# Altium schematic sheet TopLevel.SchDoc
size A4
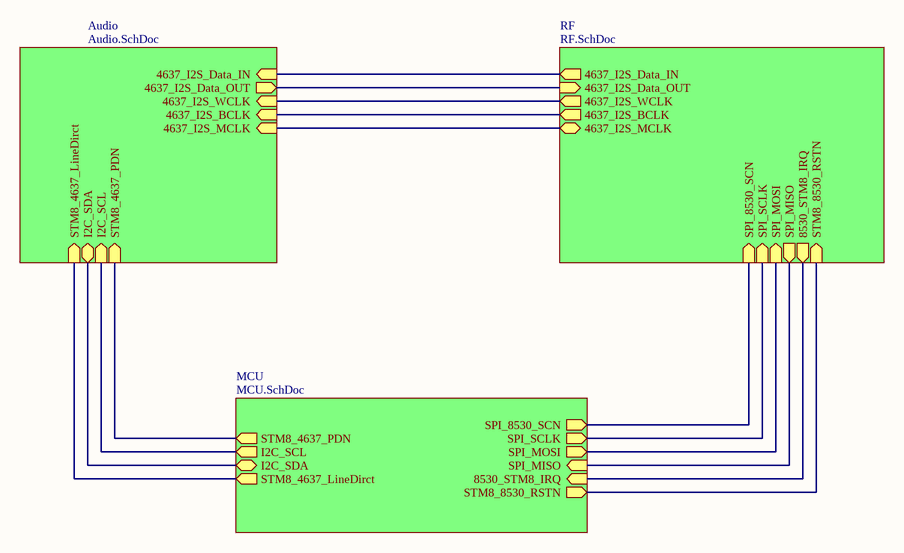
[diagram p0: TopLevel.SchDoc]

## Sub-sheets
Audio = Audio.SchDoc: 4637_I2S_Data_IN (in), 4637_I2S_Data_OUT (out), 4637_I2S_WCLK (in), 4637_I2S_BCLK (in), 4637_I2S_MCLK (in), STM8_4637_PDN (in), I2C_SCL (in), I2C_SDA (bidir), STM8_4637_LineDirct (in)
MCU = MCU.SchDoc: STM8_4637_PDN (out), I2C_SCL (out), I2C_SDA (bidir), STM8_4637_LineDirct (out), SPI_8530_SCN (out), SPI_SCLK (out), SPI_MOSI (out), SPI_MISO (in), 8530_STM8_IRQ (in), STM8_8530_RSTN (out)
RF = RF.SchDoc: 4637_I2S_Data_IN (out), 4637_I2S_Data_OUT (in), 4637_I2S_WCLK (out), 4637_I2S_BCLK (out), 4637_I2S_MCLK, SPI_8530_SCN (in), SPI_SCLK (in), SPI_MOSI (in), SPI_MISO (out), 8530_STM8_IRQ (out), STM8_8530_RSTN (in)

## Nets
(unnamed): sheet MCU/STM8_4637_PDN, sheet Audio/STM8_4637_PDN
(unnamed): sheet MCU/I2C_SCL, sheet Audio/I2C_SCL
(unnamed): sheet MCU/I2C_SDA, sheet Audio/I2C_SDA
(unnamed): sheet MCU/STM8_4637_LineDirct, sheet Audio/STM8_4637_LineDirct
(unnamed): sheet MCU/SPI_8530_SCN, sheet RF/SPI_8530_SCN
(unnamed): sheet MCU/SPI_SCLK, sheet RF/SPI_SCLK
(unnamed): sheet MCU/SPI_MOSI, sheet RF/SPI_MOSI
(unnamed): sheet MCU/SPI_MISO, sheet RF/SPI_MISO
(unnamed): sheet MCU/8530_STM8_IRQ, sheet RF/8530_STM8_IRQ
(unnamed): sheet MCU/STM8_8530_RSTN, sheet RF/STM8_8530_RSTN
(unnamed): sheet RF/4637_I2S_Data_IN, sheet Audio/4637_I2S_Data_IN
(unnamed): sheet RF/4637_I2S_Data_OUT, sheet Audio/4637_I2S_Data_OUT
(unnamed): sheet RF/4637_I2S_WCLK, sheet Audio/4637_I2S_WCLK
(unnamed): sheet RF/4637_I2S_BCLK, sheet Audio/4637_I2S_BCLK
(unnamed): sheet RF/4637_I2S_MCLK, sheet Audio/4637_I2S_MCLK